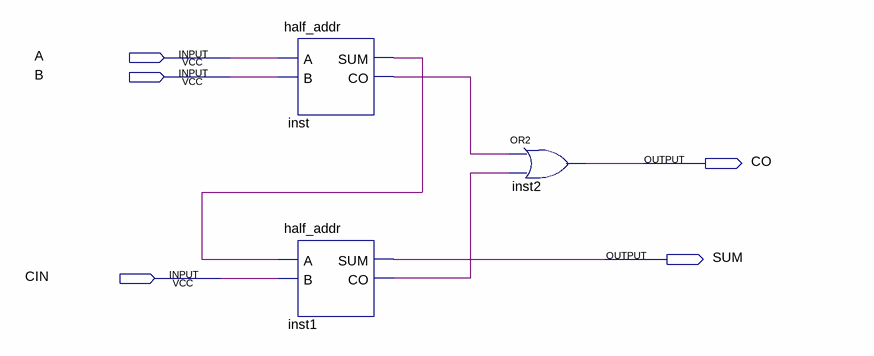
[diagram p0: schematic sheet]
// Quartus schematic full_addr.bdf as structural Verilog: 3 symbols, 5 pins
module full_addr (
  input  A,
  input  B,
  input  CIN,
  output CO,
  output SUM
);

  wire inst1_co, inst_co, inst_sum;

  half_addr inst (.A(A), .B(B), .SUM(inst_sum), .CO(inst_co));
  half_addr inst1 (.A(inst_sum), .B(CIN), .SUM(SUM), .CO(inst1_co));
  or inst2 (CO, inst_co, inst1_co);
endmodule
